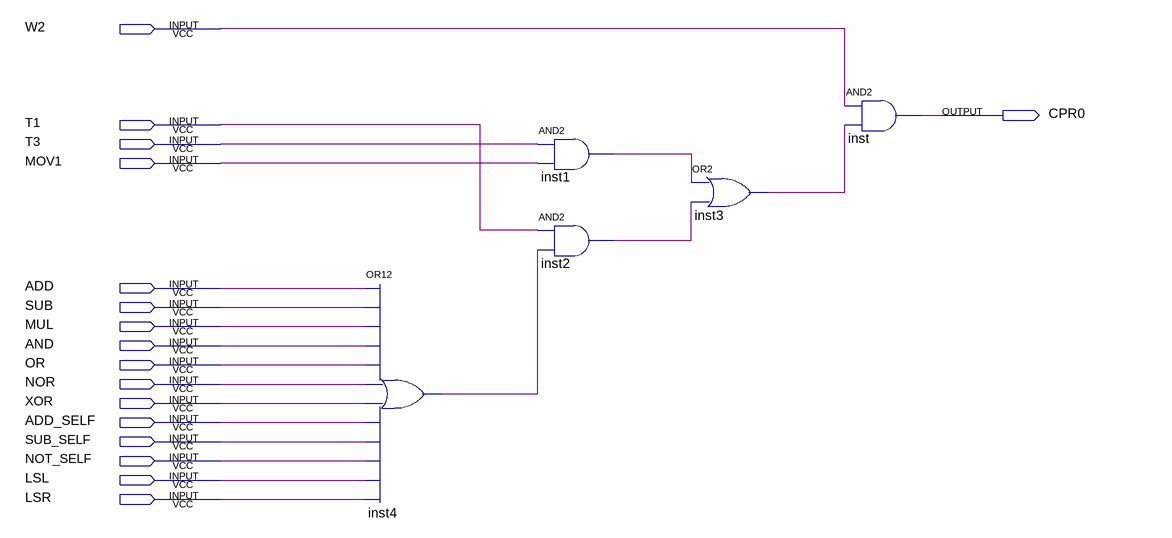
[diagram p0: schematic sheet]
// Quartus schematic CPR0.bdf as structural Verilog: 5 symbols, 17 pins
module CPR0 (
  input  W2,
  input  T1,
  input  T3,
  input  MOV1,
  input  ADD,
  input  SUB,
  input  MUL,
  input  AND,
  input  OR,
  input  NOR,
  input  XOR,
  input  ADD_SELF,
  input  SUB_SELF,
  input  NOT_SELF,
  input  LSL,
  input  LSR,
  output CPR0
);

  wire inst1_out, inst2_out, inst3_out, inst4_out;

  or inst4 (inst4_out, ADD, SUB, MUL, AND, OR, NOR, XOR, ADD_SELF, SUB_SELF, NOT_SELF, LSL, LSR);
  and inst1 (inst1_out, T3, MOV1);
  and inst2 (inst2_out, T1, inst4_out);
  or inst3 (inst3_out, inst1_out, inst2_out);
  and inst (CPR0, W2, inst3_out);
endmodule
